# EAGLE design MegaFDC (EAGLE 7.2.0)
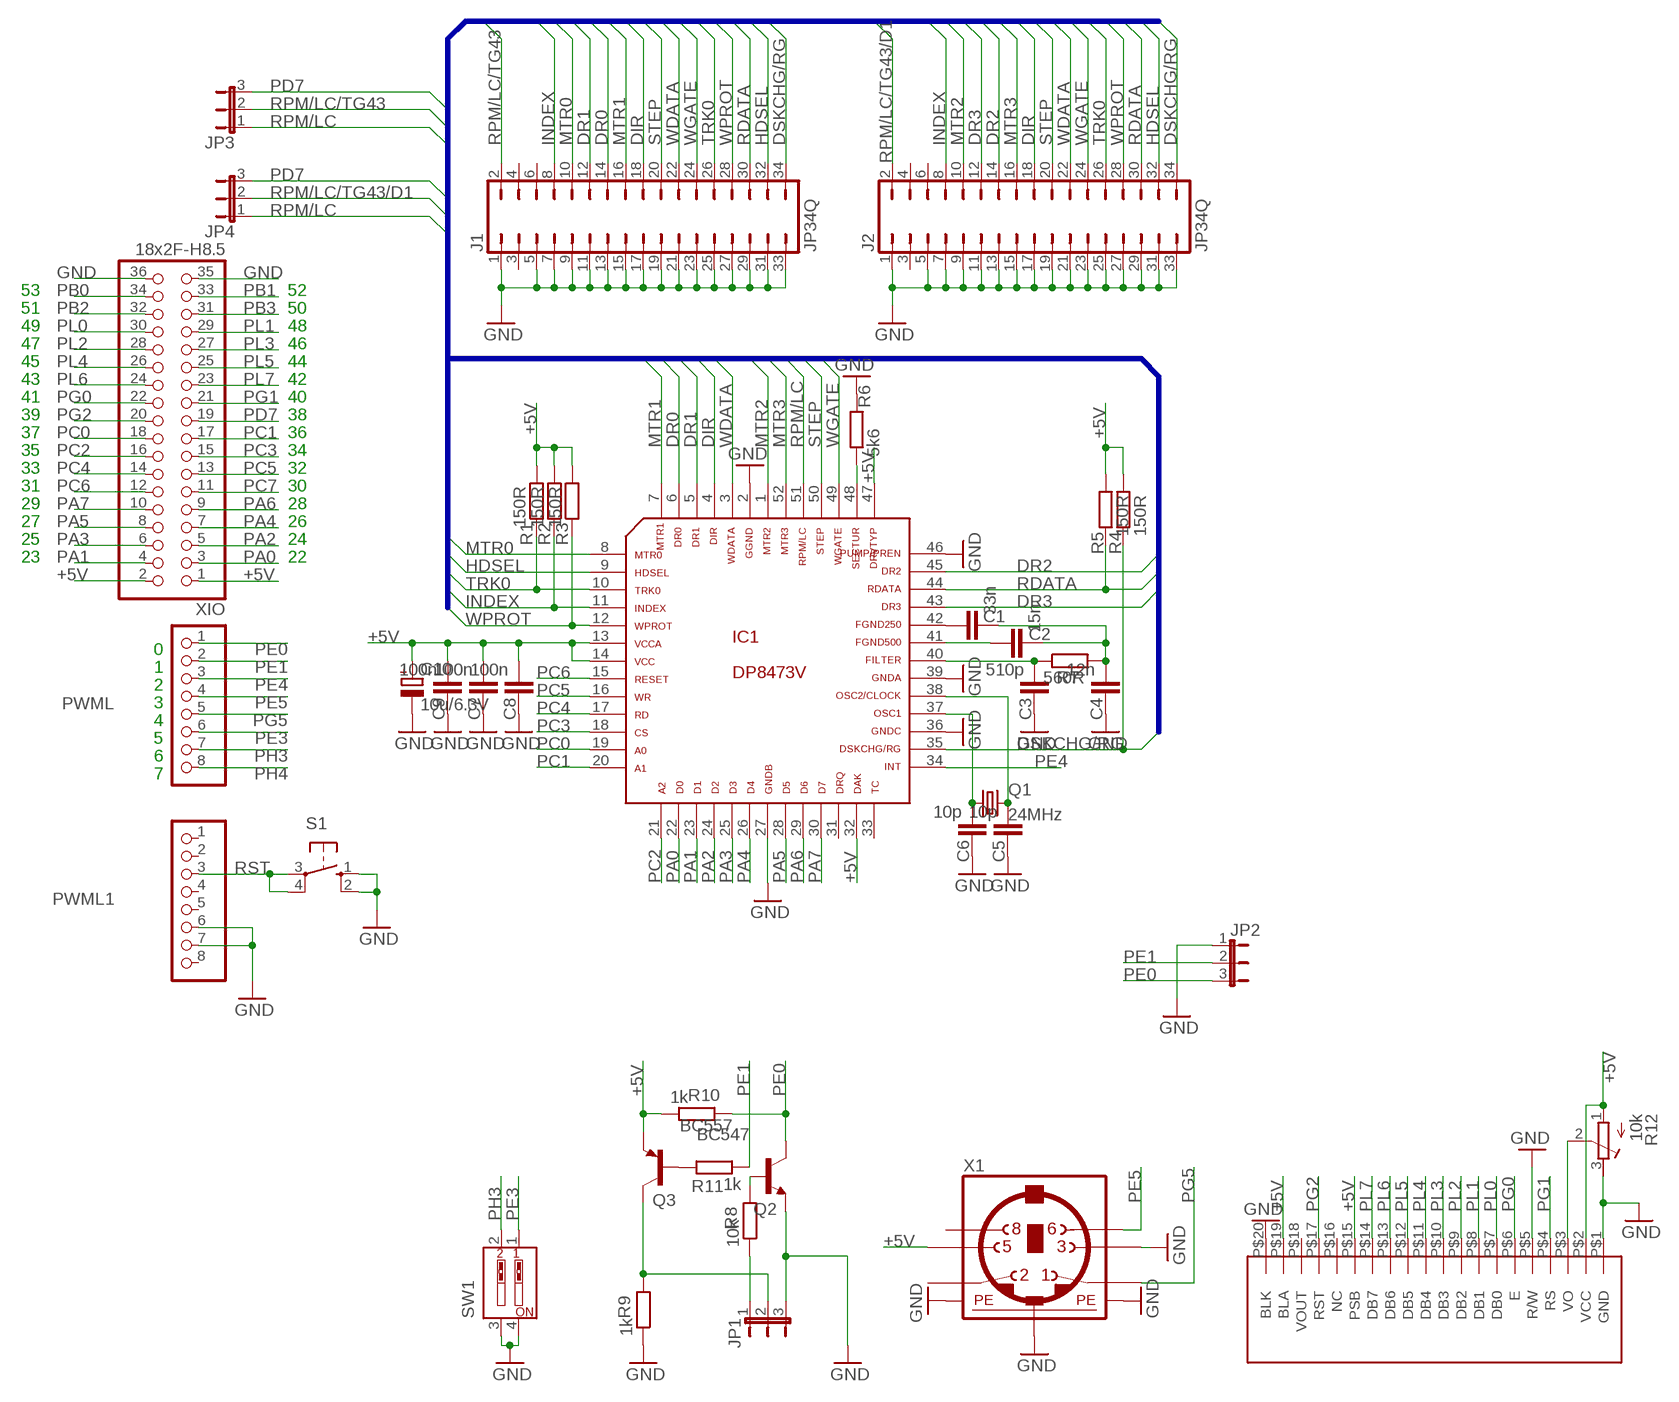
[diagram p0: schematic, sheet 1]

## Parts
C1  33n  C-EU025-025X050  [C025-025X050]
C2  15n  C-EU025-025X050  [C025-025X050]
C3  510p  C-EU025-025X050  [C025-025X050]
C4  12n  C-EU025-025X050  [C025-025X050]
C5  10p  C-EU025-025X050  [C025-025X050]
C6  10p  C-EU025-025X050  [C025-025X050]
C7  100n  C-EU050-025X075  [C050-025X075]
C8  100n  C-EU050-025X075  [C050-025X075]
C9  100n  C-EU050-025X075  [C050-025X075]
C10  10u/6.3V  CPOL-EUB45181A  [B45181A]
IC1  DP8473V  DP8473V"  [S52]
J1  JP34Q  [JP34Q]
J2  JP34Q  [JP34Q]
JP1  JP2E  [JP2]
JP2  JP2E  [JP2]
JP3  JP2E  [JP2]
JP4  JP2E  [JP2]
PWML  8x1F-H8.5  PINHD-1X8  [1X08]
PWML1  8x1F-H8.5  PINHD-1X8  [1X08]
Q1  24MHz  CRYSTALHC49S  [HC49/S]
Q2  BC547  BC547S  [TO92S]
Q3  BC557  [TO92-EBC]
R1  150R  R-EU_0207/7  [0207/7]
R2  150R  R-EU_0207/7  [0207/7]
R3  150R  R-EU_0207/7  [0207/7]
R4  150R  R-EU_0207/7  [0207/7]
R5  150R  R-EU_0207/7  [0207/7]
R6  5k6  R-EU_0207/7  [0207/7]
R7  560R  R-EU_0207/7  [0207/7]
R8  10k  R-EU_0207/7  [0207/7]
R9  1k  R-EU_0207/7  [0207/7]
R10  1k  R-EU_0207/7  [0207/7]
R11  1k  R-EU_0207/7  [0207/7]
R12  10k  R-TRIMM3296Y  [RTRIM3296Y]
S1  10-XX  [B3F-10XX]
SW1  DIP2X  [EDG-02]
U$1  W12864  [W12864]
X1  MINI_DIN_6  [M_DIN6]
XIO  18x2F-H8.5  PINHD-2X18  [2X18]

## Nets
+5V: C7.2 C8.2 C9.2 C10.+ IC1.13 IC1.14 IC1.32 IC1.47 Q3.E R1.2 R2.2 R3.2 R4.2 R5.2 R10.1 R12.1(A) U$1.P$2(VCC) U$1.P$15(PSB) U$1.P$19(BLA) X1.5 XIO.1 XIO.2
DIR: IC1.4 J1.18 J2.18
DR0: IC1.6 J1.14
DR1: IC1.5 J1.12
DR2: IC1.45 J2.14
DR3: IC1.43 J2.12
DSKCHG/RG: IC1.35 J1.34 J2.34 R4.1
GND: C3.1 C4.1 C5.1 C6.1 C7.1 C8.1 C9.1 C10.- IC1.2 IC1.27 IC1.36 IC1.39 IC1.46 J1.1 J1.5 J1.7 J1.9 J1.11 J1.13 J1.15 J1.17 J1.19 J1.21 J1.23 J1.25 J1.27 J1.29 J1.31 J1.33 J2.1 J2.5 J2.7 J2.9 J2.11 J2.13 J2.15 J2.17 J2.19 J2.21 J2.23 J2.25 J2.27 J2.29 J2.31 J2.33 JP1.3 JP2.1 PWML1.6 PWML1.7 Q2.1(E) R6.2 R9.1 R12.3(E) S1.1(S) S1.2(S1) SW1.3 SW1.4 U$1.P$1(GND) U$1.P$5(R/W) U$1.P$20(BLK) X1.3 X1.SH1(PE1) X1.SH2(PE2) X1.SH3(PE3) XIO.35 XIO.36
HDSEL: IC1.9 J1.32 J2.32
INDEX: IC1.11 J1.8 J2.8 R2.1
MTR0: IC1.8 J1.10
MTR1: IC1.7 J1.16
MTR2: IC1.1 J2.10
MTR3: IC1.52 J2.16
N$1: C1.1 IC1.42
N$2: C2.1 IC1.41
N$3: C1.2 C2.2 C4.2 R7.2
N$4: C3.2 IC1.40 R7.1
N$5: C5.2 IC1.38 Q1.2
N$6: IC1.48 R6.1
N$7: C6.2 IC1.37 Q1.1
N$8: JP1.1 R8.1
N$9: Q2.2(B) R8.2
N$12: JP1.2 Q3.C R9.2
N$13: Q3.B R11.2
N$14: R12.2(S) U$1.P$3(VO)
PA0: IC1.22 XIO.3
PA1: IC1.23 XIO.4
PA2: IC1.24 XIO.5
PA3: IC1.25 XIO.6
PA4: IC1.26 XIO.7
PA5: IC1.28 XIO.8
PA6: IC1.29 XIO.9
PA7: IC1.30 XIO.10
PB0: XIO.34
PB1: XIO.33
PB2: XIO.32
PB3: XIO.31
PC0: IC1.19 XIO.18
PC1: IC1.20 XIO.17
PC2: IC1.21 XIO.16
PC3: IC1.18 XIO.15
PC4: IC1.17 XIO.14
PC5: IC1.16 XIO.13
PC6: IC1.15 XIO.12
PC7: XIO.11
PD7: JP3.3 JP4.3 XIO.19
PE0: JP2.3 PWML.1 Q2.3(C) R10.2
PE1: JP2.2 PWML.2 R11.1
PE3: PWML.6 SW1.1
PE4: IC1.34 PWML.3
PE5: PWML.4 X1.6
PG0: U$1.P$6(E) XIO.22
PG1: U$1.P$4(RS) XIO.21
PG2: U$1.P$17(RST) XIO.20
PG5: PWML.5 X1.1
PH3: PWML.7 SW1.2
PH4: PWML.8
PL0: U$1.P$7(DB0) XIO.30
PL1: U$1.P$8(DB1) XIO.29
PL2: U$1.P$9(DB2) XIO.28
PL3: U$1.P$10(DB3) XIO.27
PL4: U$1.P$11(DB4) XIO.26
PL5: U$1.P$12(DB5) XIO.25
PL6: U$1.P$13(DB6) XIO.24
PL7: U$1.P$14(DB7) XIO.23
RDATA: IC1.44 J1.30 J2.30 R5.1
RPM/LC: IC1.51 JP3.1 JP4.1
RPM/LC/TG43: J1.2 JP3.2
RPM/LC/TG43/D1: J2.2 JP4.2
RST: PWML1.3 S1.3(P) S1.4(P1)
STEP: IC1.50 J1.20 J2.20
TRK0: IC1.10 J1.26 J2.26 R1.1
WDATA: IC1.3 J1.22 J2.22
WGATE: IC1.49 J1.24 J2.24
WPROT: IC1.12 J1.28 J2.28 R3.1
Unconnected: IC1.31 IC1.33 J1.3 J1.4 J1.6 J2.3 J2.4 J2.6 PWML1.1 PWML1.2 PWML1.4 PWML1.5 PWML1.8 U$1.P$16(NC) U$1.P$18(VOUT) X1.2 X1.8

## Buses
MTR[0..3],HDSEL,TRK0,INDEX,WPROT,DR[0..3],DIR,WDATA,RPM/LC,STEP,WGATE,RDATA,DSKCHG/RG,PD7,RPM/LC/TG43/,RPM/LC/TG43/D1

## Notes on the sheet
- 53 | 52
- 51 | 50
- 49 | 48
- 47 | 46
- 45 | 44
- 43 | 42
- 41 | 40
- 39 | 38
- 37 | 36
- 35 | 34
- 33 | 32
- 31 | 30
- 29 | 28
- 27 | 26
- 25 | 24
- 23 | 22
- 0
- 1
- 2
- 3
- 4
- 5
- 6
- 7

## Library data of the parts
C1-C9 = rcl:C-EU: CAPACITOR, European symbol
C10 = rcl:CPOL-EU: POLARIZED CAPACITOR, European symbol
IC1 = plcc-socket:DP8473V
J1 J2 = jumper:JP34Q
JP1-JP4 = jumper:JP2E: JUMPER
PWML PWML1 = SmartPrj:PINHD-1X8: PIN HEADER
Q1 = crystal:CRYSTAL: CRYSTAL; OC_FARNELL: 1667008; OC_NEWARK: unknown
Q2 = transistor-npn:BC547*: NPN Transistor
Q3 = transistor-pnp:BC557*: PNP Transistror
R1-R11 = rcl:R-EU_: RESISTOR, European symbol
R12 = rcl:R-TRIMM: Trimm resistor
S1 = switch-omron:10-XX: OMRON SWITCH; MPN: B3F-1000; OC_FARNELL: 176432; OC_NEWARK: 36M3542
SW1 = GM99:DIP2X
U$1 = w12864:W12864
X1 = mini_din:MINI_DIN_6
XIO = SmartPrj:PINHD-2X18: PIN HEADER

## Net classes
0 default: width 0.203 mm, drill 0.406 mm, clearance 0.203 mm
1 power: width 0.61 mm, drill 0.406 mm, clearance 0.203 mm
2 gnd: width 0.305 mm, drill 0.406 mm, clearance 0.203 mm
3 power usb: width 0.508 mm, drill 0.406 mm, clearance 0.203 mm

## Board
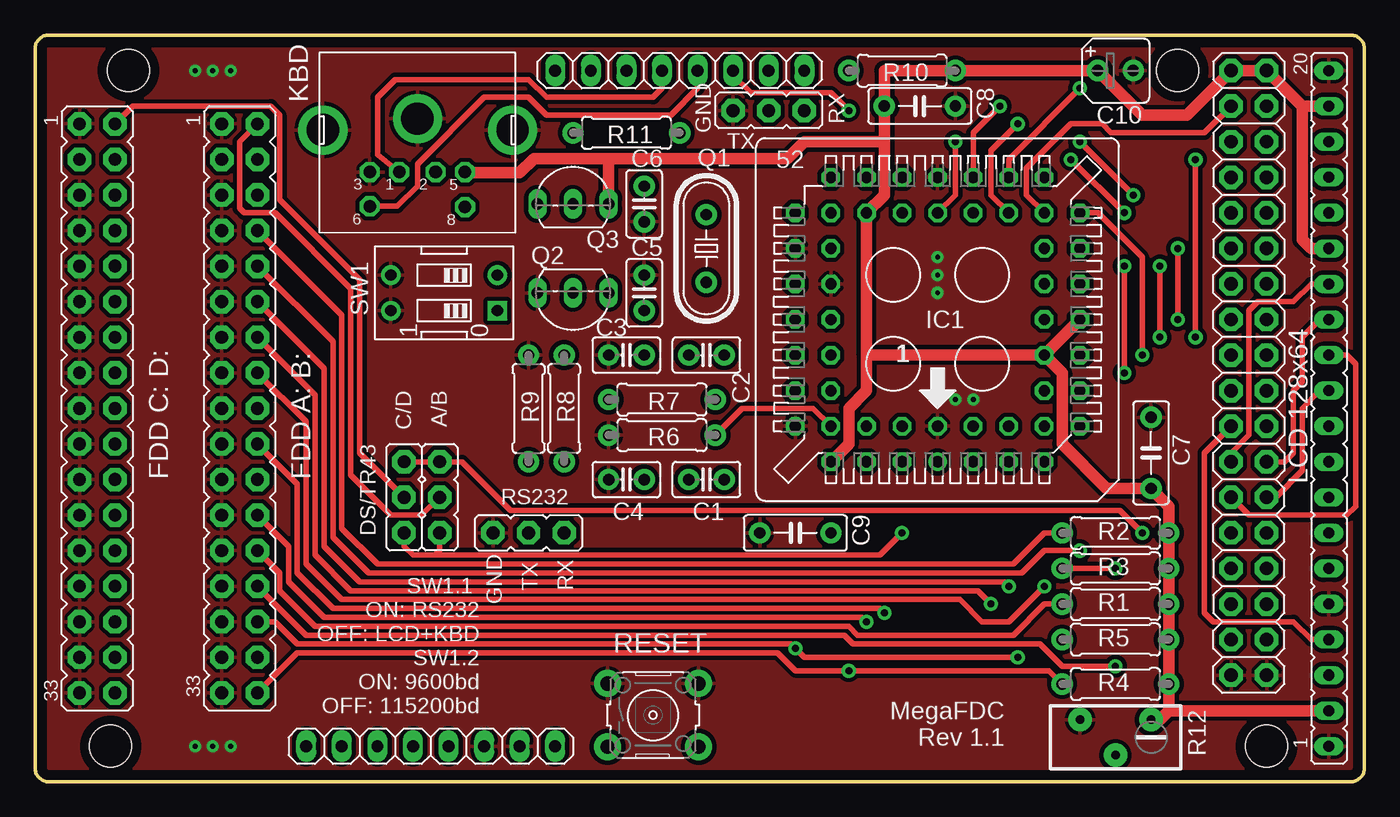
[diagram p1: board, top side]
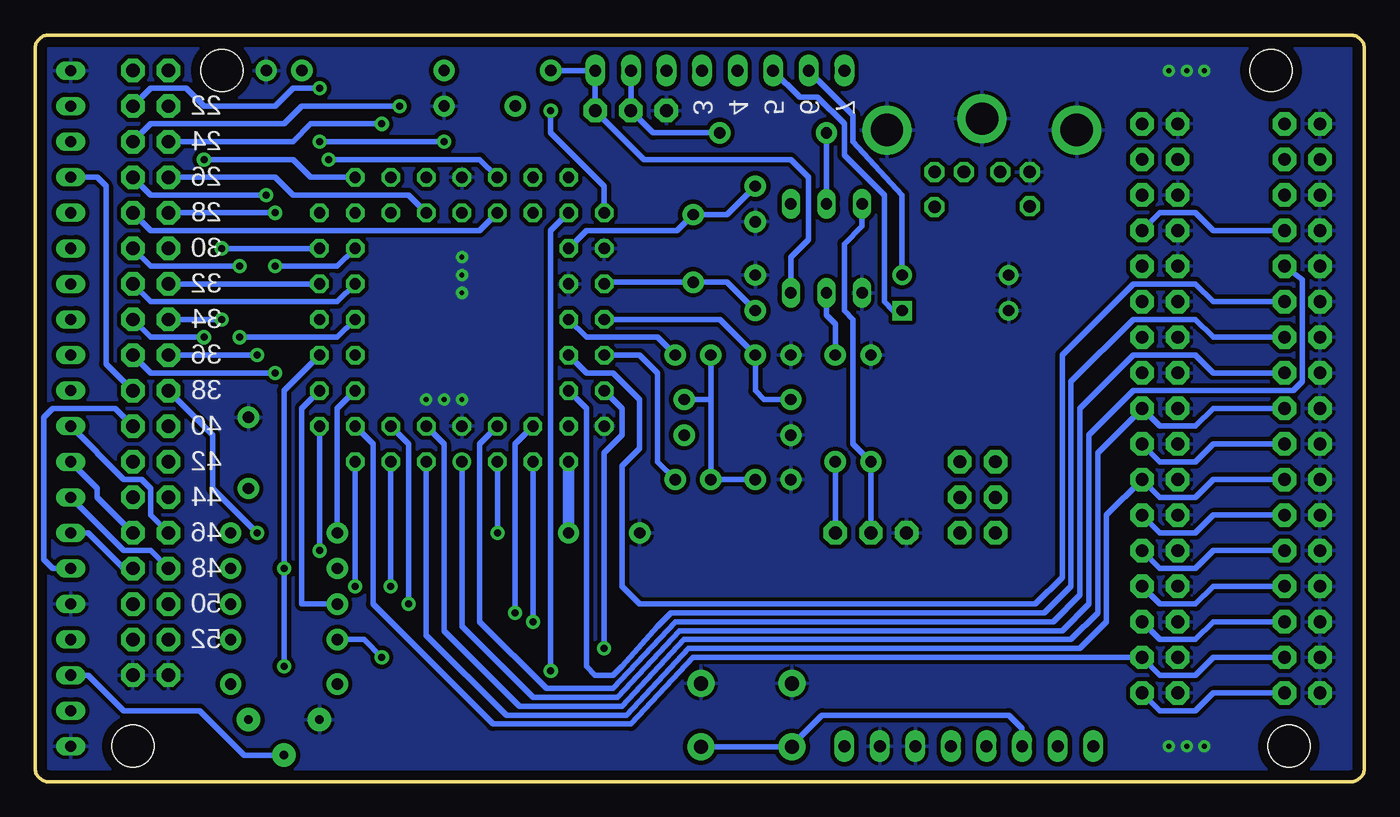
[diagram p2: board, bottom side, seen from below]

Size 94.93 x 53.34 mm. Coordinates in mm from the lower left corner, seen from the top.
Outline: 93.93,53.34 1,53.34 arc90 0,52.34 0,1 arc90 1,0 93.93,0 arc90 94.93,1 94.93,1.27 94.92,3.81 94.92,38.1 94.93,40.64 94.93,52.34
Outline: 93.93,53.34 93.98,53.34
Outline: 94.93,52.39 94.93,52.34
Outline: 93.93,53.34 arc-90 94.93,52.34
Copper layers (1*16): Top 0.035mm / dielectric 1.5mm / Bottom 0.035mm
Design rules "default": minimum track width 8mil, minimum drill 16mil, track to track 7mil, track to pad 7mil, pad to pad 8mil, via to via 10mil, smd to smd 7mil, copper to edge 27mil, drill to drill 12mil, minimum pad ring 10mil, minimum via ring 10mil, stop-mask expansion 2mil, vias tented up to drill 24mil, thermal gap 10mil
Holes 3 mm at 87.95,2.54 6.67,50.8 81.6,50.8 5.4,2.54

### Footprints (pad centres in the part's own frame; a part is rotated, then mirrored left to right if it is on the bottom)
C025-025X050 = drill 0.813 pad 1.524: 1 -1.27,0; 2 1.27,0
C050-025X075 = drill 0.813 pad 1.524: 1 -2.54,0; 2 2.54,0
B45181A = drill 0.813 pad 1.524: + -1.27,0; - 1.27,0
S52 = drill 0.813: 1 0,10.16 | drill 0.813 octagon: 2 0,7.62; 3 -2.54,10.16; 4 -2.54,7.62; 5 -5.08,10.16; 6 -5.08,7.62; 7 -7.62,10.16; 8 -10.16,7.62; 9 -7.62,7.62; 10 -10.16,5.08; 11 -7.62,5.08; 12 -10.16,2.54; 13 -7.62,2.54; 14 -10.16,0; 15 -7.62,0; 16 -10.16,-2.54; 17 -7.62,-2.54; 18 -10.16,-5.08; 19 -7.62,-5.08; 20 -10.16,-7.62; 21 -7.62,-10.16; 22 -7.62,-7.62; 23 -5.08,-10.16; 24 -5.08,-7.62; 25 -2.54,-10.16; 26 -2.54,-7.62; 27 0,-10.16; 28 0,-7.62; 29 2.54,-10.16; 30 2.54,-7.62; 31 5.08,-10.16; 32 5.08,-7.62; 33 7.62,-10.16; 34 10.16,-7.62; 35 7.62,-7.62; 36 10.16,-5.08; 37 7.62,-5.08; 38 10.16,-2.54; 39 7.62,-2.54; 40 10.16,0; 41 7.62,0; 42 10.16,2.54; 43 7.62,2.54; 44 10.16,5.08; 45 7.62,5.08; 46 10.16,7.62; 47 7.62,10.16; 48 7.62,7.62; 49 5.08,10.16; 50 5.08,7.62; 51 2.54,10.16; 52 2.54,7.62
JP34Q = drill 0.914 pad 1.676 octagon: 1 -20.32,-1.27; 2 -20.32,1.27; 3 -17.78,-1.27; 4 -17.78,1.27; 5 -15.24,-1.27; 6 -15.24,1.27; 7 -12.7,-1.27; 8 -12.7,1.27; 9 -10.16,-1.27; 10 -10.16,1.27; 11 -7.62,-1.27; 12 -7.62,1.27; 13 -5.08,-1.27; 14 -5.08,1.27; 15 -2.54,-1.27; 16 -2.54,1.27; 17 0,-1.27; 18 0,1.27; 19 2.54,-1.27; 20 2.54,1.27; 21 5.08,-1.27; 22 5.08,1.27; 23 7.62,-1.27; 24 7.62,1.27; 25 10.16,-1.27; 26 10.16,1.27; 27 12.7,-1.27; 28 12.7,1.27; 29 15.24,-1.27; 30 15.24,1.27; 31 17.78,-1.27; 32 17.78,1.27; 33 20.32,-1.27; 34 20.32,1.27
JP2 = drill 0.914 pad 1.676 octagon: 1 -2.54,0; 2 0,0; 3 2.54,0
1X08 = drill 0.85 pad 1.422 long: 1 -8.89,0; 2 -6.35,0; 3 -3.81,0; 4 -1.27,0; 5 1.27,0; 6 3.81,0; 7 6.35,0; 8 8.89,0
HC49/S = drill 0.813 pad 1.524: 1 -2.413,0; 2 2.413,0
TO92S = drill 0.813 long: 1 2.54,0; 2 0,0; 3 -2.54,0
TO92-EBC = drill 0.813 long: B 0,-1.27; C -2.54,-1.27; E 2.54,-1.27
0207/7 = drill 0.813 pad 1.524: 1 -3.81,0; 2 3.81,0
RTRIM3296Y = drill 0.61 pad 1.676: 1 1.27,-2.54; 2 -1.27,0; 3 1.27,2.54
B3F-10XX = drill 1.016 pad 1.93: 1 -3.251,2.261; 2 3.251,2.261; 3 -3.251,-2.261; 4 3.251,-2.261
EDG-02 = drill 0.813 pad 1.397 square: 1 0,0 | drill 0.813 pad 1.397: 2 2.54,0; 3 2.54,7.62; 4 0,7.62
W12864 = drill 0.8 long: P$1 24.13,0; P$2 21.59,0; P$3 19.05,0; P$4 16.51,0; P$5 13.97,0; P$6 11.43,0; P$7 8.89,0; P$8 6.35,0; P$9 3.81,0; P$10 1.27,0; P$11 -1.27,0; P$12 -3.81,0; P$13 -6.35,0; P$14 -8.89,0; P$15 -11.43,0; P$16 -13.97,0; P$17 -16.51,0; P$18 -19.05,0; P$19 -21.59,0; P$20 -24.13,0
M_DIN6 = drill 0.9 pad 1.422 octagon: 1 -1.3,-3.75; 2 1.3,-3.75; 3 -3.4,-3.75; 5 3.4,-3.75; 6 -3.4,-6.2; 8 3.4,-6.25 | drill 2.3 pad 3.5: SH1 6.8,-0.75; SH2 0,0.05; SH3 -6.75,-0.75
2X18 = drill 0.95 pad 1.676 octagon: 1 -21.59,-1.27; 2 -21.59,1.27; 3 -19.05,-1.27; 4 -19.05,1.27; 5 -16.51,-1.27; 6 -16.51,1.27; 7 -13.97,-1.27; 8 -13.97,1.27; 9 -11.43,-1.27; 10 -11.43,1.27; 11 -8.89,-1.27; 12 -8.89,1.27; 13 -6.35,-1.27; 14 -6.35,1.27; 15 -3.81,-1.27; 16 -3.81,1.27; 17 -1.27,-1.27; 18 -1.27,1.27; 19 1.27,-1.27; 20 1.27,1.27; 21 3.81,-1.27; 22 3.81,1.27; 23 6.35,-1.27; 24 6.35,1.27; 25 8.89,-1.27; 26 8.89,1.27; 27 11.43,-1.27; 28 11.43,1.27; 29 13.97,-1.27; 30 13.97,1.27; 31 16.51,-1.27; 32 16.51,1.27; 33 19.05,-1.27; 34 19.05,1.27; 35 21.59,-1.27; 36 21.59,1.27

### Placement (x,y rotation side)
C1  47.94,21.59 180 top
C2  47.94,30.48 180 top
C3  42.23,30.48 0 top
C4  42.23,21.59 0 top
C5  43.5,34.92 270 top
C6  43.5,41.27 90 top
C7  79.69,23.5 270 top
C8  63.18,48.26 180 top
C9  54.29,17.78 0 top
C10  77.15,50.8 0 top
IC1  64.45,33.02 180 top
J1  14.61,26.67 270 top
J2  4.45,26.67 270 top
JP1  35.24,17.78 180 top
JP2  52.39,47.94 0 top
JP3  28.89,20.32 90 top
JP4  26.35,20.32 90 top
PWML  46.04,50.8 180 top
PWML1  28.26,2.54 0 top
Q1  47.94,38.1 270 top
Q2  38.42,34.92 180 top
Q3  38.42,42.55 0 top
R1  77.15,12.7 0 top
R2  77.15,17.78 0 top
R3  77.15,15.24 0 top
R4  77.15,6.99 0 top
R5  77.15,10.16 0 top
R6  44.77,24.77 180 top
R7  44.77,27.3 0 top
R8  37.78,26.67 90 top
R9  35.24,26.67 270 top
R10  61.91,50.8 180 top
R11  42.23,46.35 180 top
R12  77.15,3.17 90 top
S1  44.13,4.76 0 top
SW1  33.02,33.66 90 top
U$1  92.39,26.67 270 top
X1  27.3,47.31 0 top
XIO  86.68,29.21 270 top

### Tracks (layer width: path | path; a pad name or v marks a point on that pad's centre or on a via)
+5V
  Top 0.813: IC1.13 IC1.14 | IC1.13 59.37,30.48 | 59.37,30.48 IC1.32 60.64,41.91 60.64,45.72 | 59.37,30.48 59.37,27.94 58.1,26.67 58.1,24.13 IC1.47 | 60.64,45.72 C8.2 60.64,50.8 R10.1 C10.+ 79.06,47.62 82.23,47.62 XIO.1 XIO.2 90.49,48.26 | IC1.13 73.34,29.21 73.34,24.13 76.52,20.95 C7.2 80.96,19.68 R2.2 R3.2 R1.2 R5.2 R4.2 80.96,5.08 | 60.64,45.72 54.93,45.72 53.72,44.51 40.96,44.51 | 40.96,44.51 35.62,44.51 34.61,43.5 30.45,43.5 X1.5 | U$1.P$19 90.49,48.26 | U$1.P$15 91.12,38.1 90.49,38.73 90.49,48.26 | U$1.P$2 80.96,5.08 | Q3.E 40.96,44.51 | 80.96,5.08 80.33,4.45 R12.1
  Bottom 0.813: C9.2 IC1.47
DIR
  Bottom 0.406: IC1.4 65.72,24.13 65.72,10.79 60.33,5.4 53.02,5.4 48.58,10.16 20.95,10.16 19.05,12.06 19.05,23.5 J1.18 14.61,25.4 12.06,25.4 10.79,26.67 J2.18
DR0  (via drill 0.5)
  Top 0.406: v68.26,12.7 67.31,13.65 22.54,13.65 20,16.19 20,27.62 J1.14
  Bottom 0.406: IC1.6 68.26,24.13 v68.26,12.7
DR1  (via drill 0.5)
  Top 0.406: v69.53,13.97 69.22,14.29 23.18,14.29 20.64,16.83 20.64,29.53 J1.12
  Bottom 0.406: IC1.5 v69.53,13.97
DR2
  Bottom 0.406: IC1.45 55.56,26.67 55.56,8.26 54.93,7.62 53.66,7.62 53.02,8.26 50.48,11.11 49.53,12.06 22.86,12.06 20.95,13.97 20.95,28.57 16.51,33.02 12.06,33.02 10.79,31.75 J2.14
DR3
  Bottom 0.406: IC1.43 55.56,29.21 53.66,29.21 51.75,27.3 51.75,23.81 53.02,22.54 53.02,13.97 51.75,12.7 23.5,12.7 21.59,14.61 21.59,30.48 16.51,35.56 12.06,35.56 10.79,34.29 J2.12
DSKCHG/RG  (via drill 0.5)
  Top 0.406: R4.1 72.39,7.94 v58.1,7.94 54.29,7.94 53.02,9.21 18.73,9.21 J1.34
  Bottom 0.406: IC1.35 58.1,39.37 v58.1,7.94 | J2.34 10.79,6.35 12.06,5.08 14.61,5.08 J1.34
GND  (via drill 0.35)
  other vias: 64.45,37.47 64.45,36.2 64.45,34.92 11.43,50.8 12.7,50.8 13.97,50.8 11.43,2.54 12.7,2.54 13.97,2.54 64.45,27.3 65.72,27.3 66.99,27.3
  pour Top (isolate 0.305, rank 2): 0.64,52.7 90.49,52.7 90.49,0.64 0.64,0.64 0.64,29.84 0.65,45.8 0.64,46.35
  pour Bottom (isolate 0.305, rank 2): 0.64,52.7 90.49,52.7 90.49,0.64 0.64,0.64 0.64,29.84 0.65,30.34 0.59,42.26 0.64,46.35
  pour Bottom (isolate 0.305, rank 2): 0.64,52.7 94.93,52.7 94.93,0.64 1.27,0.64 0.64,1.27 0.64,27.3 0.65,27.8 0.59,39.72 0.64,43.81
  pour Bottom (isolate 0.305, rank 2): 0.64,52.7 94.93,52.7 94.93,0.64 1.27,0.64 0.64,1.27 0.64,27.3 0.65,27.8 0.59,39.72 0.64,43.81
  pour Top (isolate 0.305, rank 2): 0.64,52.7 94.93,52.7 94.93,0.64 0.64,0.64 0.64,27.3 0.65,43.27 0.64,43.81
HDSEL
  Bottom 0.406: IC1.9 70.8,24.13 70.8,12.7 62.23,4.13 52.39,4.13 47.94,8.89 J1.32 14.61,7.62 12.06,7.62 10.79,8.89 J2.32
INDEX
  Top 0.406: R2.1 72.07,17.78 69.85,15.56 24.45,15.56 21.91,18.1 21.91,33.34 J1.8
  Bottom 0.406: IC1.11 73.34,26.67 R2.1 | J1.8 14.61,40.64 12.06,40.64 10.79,39.37 J2.8
MTR0  (via drill 0.5)
  Top 0.406: J1.10 21.27,31.43 21.27,17.46 23.81,14.92 70.48,14.92 72.07,16.51 v74.61,16.51
  Bottom 0.406: IC1.8 v74.61,16.51
MTR1  (via drill 0.5)
  Top 0.406: J1.16 19.37,25.72 19.37,15.56 21.91,13.02 66.04,13.02 67.63,11.43 69.53,11.43 v72.07,13.97
  Bottom 0.406: IC1.7 v72.07,13.97
MTR2
  Bottom 0.406: J2.10 4.45,35.88 4.45,28.57 5.08,27.94 16.51,27.94 19.68,24.77 19.68,12.7 21.59,10.79 48.9,10.79 53.34,6.03 59.37,6.03 64.45,11.11 IC1.1
MTR3
  Bottom 0.406: IC1.52 63.18,24.13 63.18,11.43 58.42,6.67 53.66,6.67 49.21,11.43 22.23,11.43 20.32,13.34 20.32,26.67 16.51,30.48 12.06,30.48 10.79,29.21 J2.16
N$1
  Bottom 0.406: IC1.42 51.75,30.48 50.48,29.21 50.48,22.86 C1.1
N$2
  Bottom 0.406: IC1.41 55.56,31.75 50.48,31.75 C2.1
N$3
  Bottom 0.406: C2.2 46.67,27.3 | 46.67,27.3 C1.2 C4.2 | R7.2 46.67,27.3
N$4
  Bottom 0.406: IC1.40 46.04,33.02 C3.2 43.5,27.94 42.86,27.3 R7.1
N$5
  Bottom 0.406: C5.2 45.53,35.69 Q1.2 54.17,35.69 IC1.38
N$6
  Top 0.406: R6.1 50.48,26.67 55.56,26.67 IC1.48
N$7
  Bottom 0.406: C6.2 45.53,40.51 Q1.1 49.09,39.37 55.56,39.37 IC1.37
N$8
  Bottom 0.406: R8.1 JP1.1
N$9
  Bottom 0.406: Q2.2 38.42,33.34 37.78,32.7 R8.2
N$12
  Bottom 0.406: Q3.C 35.88,39.69 37.15,38.42 37.15,33.66 36.51,33.02 36.51,24.13 R9.2 JP1.2
N$13
  Bottom 0.406: R11.2 Q3.B
N$14
  Bottom 0.406: U$1.P$3 91.12,7.62 88.58,5.08 83.19,5.08 80.01,1.91 R12.2
PA0
  Top 0.406: IC1.22 70.8,41.91 70.8,43.81 73.98,46.99 76.2,46.99 76.83,46.35 83.5,46.35 XIO.3
PA1  (via drill 0.5)
  Top 0.406: IC1.23 69.53,44.45 v74.61,49.53
  Bottom 0.406: XIO.4 86.68,49.53 84.14,49.53 82.87,48.26 77.79,48.26 76.52,49.53 v74.61,49.53
PA2  (via drill 0.5)
  Top 0.406: IC1.24 68.26,41.91 68.26,45.09 v70.17,46.99
  Bottom 0.406: v70.17,46.99 75.25,46.99 76.52,45.72 XIO.5
PA3  (via drill 0.5)
  Top 0.406: IC1.25 66.99,46.35 v68.9,48.26
  Bottom 0.406: XIO.6 86.68,46.99 77.15,46.99 75.88,48.26 v68.9,48.26
PA4
  Bottom 0.406: IC1.26 68.26,41.91 76.52,41.91 77.79,43.18 XIO.7
PA5  (via drill 0.5)
  Top 0.406: v65.72,45.72 65.72,41.91 IC1.28 | v74.61,45.72 v78.42,41.91
  Bottom 0.406: XIO.8 86.68,41.91 v78.42,41.91 | v74.61,45.72 v65.72,45.72
PA6  (via drill 0.5)
  Top 0.406: v77.79,40.64 v73.98,44.45
  Bottom 0.406: XIO.9 v77.79,40.64 | v73.98,44.45 63.18,44.45 IC1.29
PA7
  Bottom 0.406: IC1.30 63.18,39.37 86.68,39.37 XIO.10
PC0  (via drill 0.5)
  Top 0.406: v77.79,36.83 v77.79,29.21
  Bottom 0.406: IC1.19 73.34,36.83 v77.79,36.83 | v77.79,29.21 86.68,29.21 XIO.18
PC1  (via drill 0.5)
  Top 0.406: v79.06,30.48 79.06,37.47 75.88,40.64 IC1.20
  Bottom 0.406: v79.06,30.48 XIO.17
PC2  (via drill 0.5)
  Top 0.406: v82.87,44.45 v82.87,31.75
  Bottom 0.406: XIO.16 86.68,31.75 v82.87,31.75 | IC1.21 75.25,43.18 76.52,44.45 v82.87,44.45
PC3  (via drill 0.5)
  Top 0.406: v81.6,38.1 v81.6,33.02
  Bottom 0.406: IC1.18 v81.6,38.1 | v81.6,33.02 XIO.15
PC4
  Bottom 0.406: XIO.14 86.68,34.29 73.34,34.29 IC1.17
PC5
  Bottom 0.406: IC1.16 XIO.13
PC6  (via drill 0.5)
  Top 0.406: v80.33,36.83 v80.33,31.75
  Bottom 0.406: XIO.12 86.68,36.83 v80.33,36.83 | v80.33,31.75 73.34,31.75 IC1.15
PD7  (via drill 0.5)
  Top 0.406: v79.06,17.78 77.47,19.37 33.97,19.37 30.48,22.86 JP3.3 JP4.3
  Bottom 0.406: XIO.19 82.23,24.77 82.23,20.95 v79.06,17.78
PE0
  Bottom 0.406: Q2.3 40.96,37.47 39.69,38.73 39.69,43.18 40.96,44.45 51.44,44.45 JP2.3 PWML.1 R10.2
PE1
  Bottom 0.406: PWML.2 JP2.2 50.8,46.35 R11.1
PE3
  Bottom 0.406: PWML.6 40.32,48.9 39.05,48.9 37.15,46.99 37.15,44.77 34.29,41.91 34.29,34.29 33.66,33.66 SW1.1
PE4  (via drill 0.5)
  Top 0.406: PWML.3 49.85,50.48 51.12,49.21 56.83,49.21 v58.1,47.94
  Bottom 0.406: v58.1,47.94 58.1,46.35 54.29,42.55 IC1.34
PE5
  Top 0.406: PWML.4 47.31,49.53 45.4,47.62 36.51,47.62 35.24,48.9 32.07,48.9 27.3,44.13 27.3,42.55 25.87,41.11 X1.6
PG0
  Bottom 0.406: U$1.P$6 93.66,15.24 94.3,15.88 94.3,26.04 93.66,26.67 89.22,26.67 XIO.22
PG1
  Top 0.406: XIO.21 83.5,23.5 83.5,12.06 84.14,11.43 89.85,11.43 91.12,10.16 U$1.P$4
PG2
  Bottom 0.406: U$1.P$17 90.49,43.18 89.85,42.55 89.85,29.84 XIO.20
PG5
  Top 0.406: PWML.5 44.77,49.53 44.13,48.9 36.51,48.9 35.24,50.16 25.72,50.16 24.45,48.9 24.45,44.8 X1.1
PH3
  Bottom 0.406: PWML.7 36.51,47.62 36.51,45.72 33.02,41.91 SW1.2
PL0
  Bottom 0.406: XIO.30 88.58,15.24 91.12,17.78 U$1.P$7
PL1
  Bottom 0.406: XIO.29 86.68,16.51 88.58,16.51 U$1.P$8
PL2
  Bottom 0.406: XIO.28 90.49,20.32 90.49,20.95 U$1.P$9
PL3
  Bottom 0.406: XIO.27 86.68,19.05 86.68,20.95 87.31,21.59 88.58,21.59 U$1.P$10
PL4
  Top 0.406: XIO.26 88.58,20.32 90.49,22.23 90.49,26.67 91.76,27.94 U$1.P$11
PL5
  Top 0.406: XIO.25 86.68,19.05 93.66,19.05 94.3,19.68 94.3,29.84 93.66,30.48 U$1.P$12
PL6
  Top 0.406: XIO.24 89.22,22.86 89.85,23.5 89.85,27.94 90.49,28.57 90.49,31.75 91.76,33.02 U$1.P$13
PL7
  Top 0.406: XIO.23 85.41,23.5 86.68,24.77 86.68,33.66 87.31,34.29 89.85,34.29 91.12,35.56 U$1.P$14
RDATA  (via drill 0.5)
  Top 0.406: v70.17,8.89 54.93,8.89 v54.29,9.53 53.98,9.84 18.73,9.84 17.14,11.43 J1.30
  Bottom 0.406: IC1.44 53.02,26.67 53.02,24.77 54.29,23.5 v54.29,9.53 | J2.30 10.79,11.43 12.06,10.16 14.61,10.16 J1.30 | R5.1 71.44,10.16 v70.17,8.89
RPM/LC  (via drill 0.5)
  Top 0.406: v61.91,17.78 60.33,16.19 28.57,16.19 | 28.57,16.19 26.99,16.19 26.35,16.83 JP4.1 | JP3.1 28.89,16.51 28.57,16.19
  Bottom 0.406: v61.91,17.78 IC1.51
RPM/LC/TG43
  Top 0.406: J1.2 14.61,45.72 14.61,40.96 14.92,40.64 17.14,40.64 22.54,35.24 22.54,21.91 25.4,19.05 27.62,19.05 JP3.2
RPM/LC/TG43/D1
  Top 0.406: J2.2 6.99,48.26 16.83,48.26 17.46,47.62 17.46,41.59 23.18,35.88 23.18,23.5 JP4.2
RST
  Bottom 0.406: S1.4 S1.3 40.88,2.62 38.73,4.76 25.4,4.76 24.45,3.81 PWML1.3
STEP  (via drill 0.5)
  Top 0.406: J1.20 18.73,21.27 18.73,14.92 21.27,12.38 60.33,12.38 v60.64,12.06
  Bottom 0.406: IC1.50 60.64,24.13 v60.64,12.06 | J2.20 10.79,24.13 12.06,22.86 14.61,22.86 J1.20
TRK0
  Top 0.406: R1.1 72.07,12.7 69.85,10.48 58.74,10.48 58.1,11.11 20,11.11 17.46,13.65 17.46,14.92 J1.26
  Bottom 0.406: IC1.10 75.88,26.67 75.88,12.7 R1.1 | J2.26 10.79,16.51 12.06,15.24 14.61,15.24 J1.26
WDATA
  Bottom 0.406: IC1.3 66.99,10.48 61.28,4.76 52.7,4.76 48.26,9.53 20.32,9.53 18.41,11.43 18.41,19.05 J1.22 14.61,20.32 12.06,20.32 10.79,21.59 J2.22
WGATE  (via drill 0.5)
  Top 0.406: J1.24 18.1,16.83 18.1,14.29 20.64,11.75 59.05,11.75 v59.37,11.43
  Bottom 0.406: v59.37,11.43 IC1.49 | J2.24 10.79,19.05 12.06,17.78 14.61,17.78 J1.24
WPROT  (via drill 0.5)
  Top 0.406: R3.1 v77.15,15.24 | v77.15,8.26 73.34,8.26 71.75,9.84 58.42,9.84 57.78,10.48 19.37,10.48 J1.28
  Bottom 0.406: IC1.12 77.15,27.94 v77.15,15.24 v77.15,8.26 | J2.28 10.79,13.97 12.06,12.7 14.61,12.7 J1.28

### Text on the board
tPlace: KBD | 20 | 1 | 1 | RX | GND | TX | LCD 128x64 | C/D | A/B | DS/TR43 | FDD C: D: | FDD A: B: | RS232 | SW1.1 / ON: RS232 / OFF: LCD+KBD / SW1.2 / ON: 9600bd / OFF: 115200bd | TX | RX | GND | RESET | 33 | 33 | MegaFDC / Rev 1.1 | 1
bPlace: 7 | 6 | 5 | 4 | 3 | 22 | 24 | 26 | 28 | 30 | 32 | 34 | 36 | 38 | 40 | 42 | 44 | 46 | 48 | 50 | 52
tNames: 1